# Altium schematic sheet TOP_PDUA_SIMPLE.SchDoc
size 635 x 241 mm
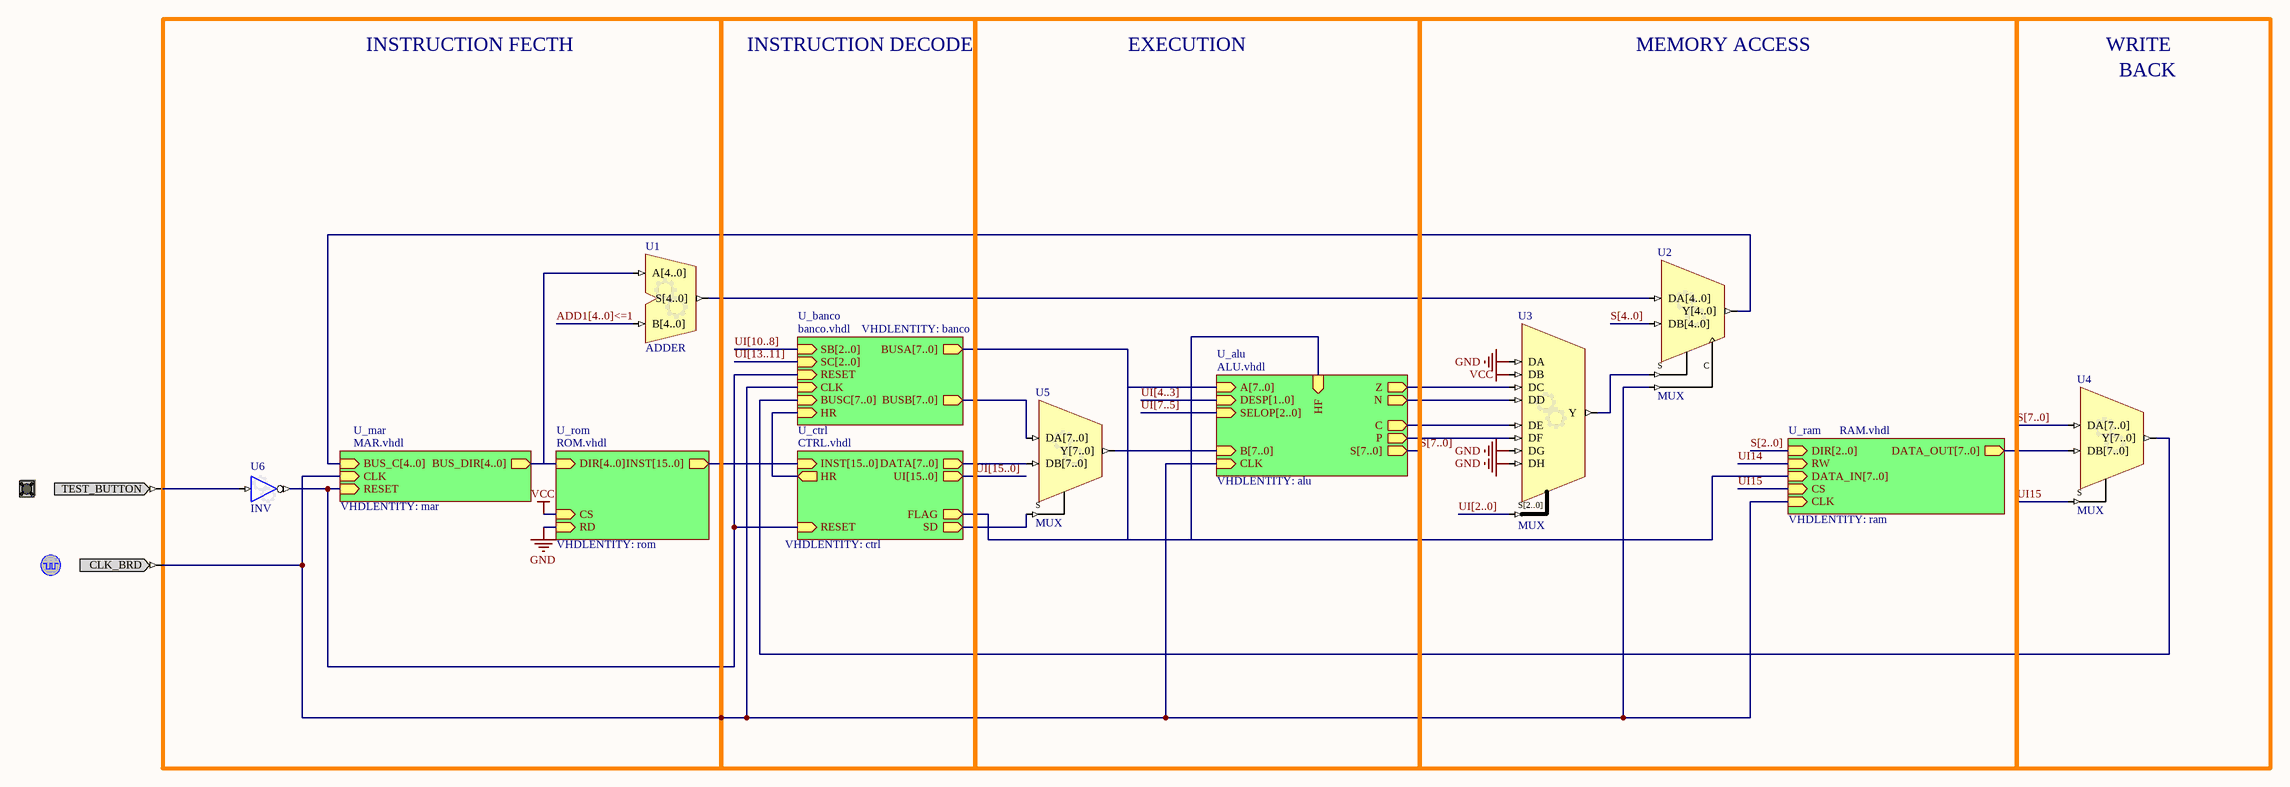
[diagram p0: TOP_PDUA_SIMPLE.SchDoc]

## Parts
(Parts that share a designator on the sheet are numbered #1, #2 ... from top to bottom, then left to right.)
?#1  TEST_BUTTON  (value not drawn)
?#2  CLOCK_BOARD  (value not drawn)
U1  ADDER
U2  MUX
U3  MUX
U4  MUX
U5  MUX
U6  INV

## Blocks framed on the sheet
INSTRUCTION FECTH: U1 U6
EXECUTION: U5
MEMORY ACCESS: U2 U3

## Sub-sheets
U_alu = ALU.vhdl: A[7..0] (in), B[7..0] (in), C (out), DESP[1..0] (in), HF (in), N (out), P (out), S[7..0] (out), SELOP[2..0] (in), Z (out), CLK (in)  | VHDLENTITY: alu
U_banco = banco.vhdl: BUSA[7..0] (out), BUSB[7..0] (out), BUSC[7..0] (in), HR (in), SB[2..0] (in), SC[2..0] (in), RESET (in), CLK (in)  | VHDLENTITY: banco
U_ctrl = CTRL.vhdl: DATA[7..0] (out), INST[15..0] (in), RESET (in), UI[15..0] (out), SD (out), HR (out), FLAG (out)  | VHDLENTITY: ctrl
U_mar = MAR.vhdl: BUS_C[4..0] (in), BUS_DIR[4..0] (out), CLK (in), RESET (in)  | VHDLENTITY: mar
U_ram = RAM.vhdl: CS (in), DATA_IN[7..0] (in), DATA_OUT[7..0] (out), DIR[2..0] (in), RW (in), CLK (in)  | VHDLENTITY: ram
U_rom = ROM.vhdl: CS (in), DIR[4..0] (in), RD (in), INST[15..0] (out)  | VHDLENTITY: rom

## Nets
GND: U3.DA U3.DG U3.DH ; sheet U_rom/RD
VCC: U3.DB ; sheet U_rom/CS
ADD1[4..0]<=1: U1.B[4..0]
S[4..0]: U2.DB[4..0]
S[7..0]: U4.DA[7..0] ; sheet U_alu/S[7..0]
UI14: sheet U_ram/RW
UI15: U4.S ; sheet U_ram/CS
UI[2..0]: U3.S[2..0]
Net?#1_TEST_BUTTON: ?#1.TEST_BUTTON U6.I
Net?#2_CLK_BRD: ?#2.CLK_BRD U2.C ; sheet U_mar/CLK, sheet U_banco/CLK, sheet U_alu/CLK, sheet U_ram/CLK
NetU1_A[4..0]: U1.A[4..0] ; sheet U_rom/DIR[4..0], sheet U_mar/BUS_DIR[4..0]
NetU1_S[4..0]: U1.S[4..0] U2.DA[4..0]
NetU2_S: U2.S U3.Y
NetU2_Y[4..0]: U2.Y[4..0] ; sheet U_mar/BUS_C[4..0]
NetU3_DC: U3.DC ; sheet U_alu/Z
NetU3_DD: U3.DD ; sheet U_alu/N
NetU3_DE: U3.DE ; sheet U_alu/C
NetU3_DF: U3.DF ; sheet U_alu/P
NetU4_DB[7..0]: U4.DB[7..0] ; sheet U_ram/DATA_OUT[7..0]
NetU4_Y[7..0]: U4.Y[7..0] ; sheet U_banco/BUSC[7..0]
NetU5_DA[7..0]: U5.DA[7..0] ; sheet U_banco/BUSB[7..0]
NetU5_DB[7..0]: U5.DB[7..0] ; sheet U_ctrl/DATA[7..0]
NetU5_S: U5.S ; sheet U_ctrl/SD
NetU5_Y[7..0]: U5.Y[7..0] ; sheet U_alu/B[7..0]
NetU6_O: U6.O ; sheet U_mar/RESET, sheet U_ctrl/RESET, sheet U_banco/RESET
(unnamed): sheet U_ctrl/HR, sheet U_banco/HR
(unnamed): sheet U_ctrl/FLAG, sheet U_alu/HF

## Buses and harness runs
bus ADD1[4..0]<=1
bus S[2..0] = sheet U_ram/DIR[2..0]
bus S[4..0]
bus S[7..0]
bus S[7..0] = sheet U_alu/S[7..0]
bus sheet U_alu/A[7..0] = sheet U_banco/BUSA[7..0] = sheet U_ram/DATA_IN[7..0]
bus sheet U_ctrl/INST[15..0] = sheet U_rom/INST[15..0]
bus sheet U_mar/BUS_DIR[4..0] = sheet U_rom/DIR[4..0]
bus UI[2..0]
bus UI[4..3] = sheet U_alu/DESP[1..0]
bus UI[7..5] = sheet U_alu/SELOP[2..0]
bus UI[10..8] = sheet U_banco/SB[2..0]
bus UI[13..11] = sheet U_banco/SC[2..0]
bus UI[15..0] = sheet U_ctrl/UI[15..0]

## Notes on the sheet
- INSTRUCTION DECODE
- WRITE
- BACK

## Library data of the parts
?#1 = TEST_BUTTON: Test / Reset Button; PortComponent: True; Published: 19-Nov-2003; Publisher: Altium Limited; HelpURL: https://wiki.altium.com/display/ADOH/NanoBoard+3000+-+Test-Reset+Button
?#2 = CLOCK_BOARD: Global System Clock Supply; PortComponent: True; Published: 19-Nov-2003; Publisher: Altium Limited; HelpURL: https://wiki.altium.com/display/ADOH/NanoBoard+3000+-+System+Clocks; UseInDSF: True
U1 = ADDER: Configurable Adder; ConfiguratorName: GENERIC_ADDER; ConfigurationParameters: {}Version[1.0]{}Type[Adder]{}SignedOverflow[False]{}UnsignedCarryOut[False]{}SignalWidth[5]{}BusInputs[True]{}BusOutput[True]{}RegisterOutputs[False]{}NegClockEdge[False]{}CarryIn[False]{}; LastRevisionNo: 1.00.00; Published: 23-Jan-2009; Publisher: Altium Limited
U2 = MUX: Configurable Mutliplexer; ConfigurationParameters: {}Version[1.0]{}ShowEnable[False]{}BusInputs[True]{}BusOutputs[True]{}SignalWidth[5]{}Type[Multiplexer]{}RegisterOutputs[True]{}NegativeClockEdge[False]{}ShowPinNames[True]{}InvertSingleSignal[False]{}SignalCount[2]{}Invert0[False]{}Invert1[False]{}; ConfiguratorName: GENERIC_MULTIPLEXER; LastRevisionNo: 1.00.00; Published: 31-Dec-2008; Publisher: Altium Limited
U3 = MUX: Configurable Mutliplexer; ConfigurationParameters: {}Version[1.0]{}ShowEnable[False]{}BusInputs[False]{}BusOutputs[False]{}SignalWidth[1]{}Type[Multiplexer]{}RegisterOutputs[False]{}NegativeClockEdge[False]{}ShowPinNames[True]{}InvertSingleSignal[False]{}SignalCount[8]{}Invert0[False]{}Invert1[False]{}Invert2[False]{}Invert3[False]{}Invert4[False]{}Invert5[False]{}Invert6[False]{}Invert7[False]{}; ConfiguratorName: GENERIC_MULTIPLEXER; LastRevisionNo: 1.00.00; Published: 31-Dec-2008; Publisher: Altium Limited
U4 U5 = MUX: Configurable Mutliplexer; ConfigurationParameters: {}Version[1.0]{}ShowEnable[False]{}BusInputs[True]{}BusOutputs[True]{}SignalWidth[8]{}Type[Multiplexer]{}RegisterOutputs[False]{}NegativeClockEdge[False]{}ShowPinNames[True]{}InvertSingleSignal[False]{}SignalCount[2]{}Invert0[False]{}Invert1[False]{}; ConfiguratorName: GENERIC_MULTIPLEXER; LastRevisionNo: 1.00.00; Published: 31-Dec-2008; Publisher: Altium Limited
U6 = INV: Configurable Inverter; ConfigurationParameters: {}Version[1.1]{}SignalCount[1]{}SignalWidth0[1]{}OutputOption0[Inverted]{}EnableMode[None]{}ShowPinNames[False]{}; ConfiguratorName: GENERIC_BUFFER; LastRevisionNo: 1.00.00; Published: 10-Oct-2008; Publisher: Altium Limited; HelpURL: https://wiki.altium.com/display/ADOH/Configurable+Generic+Library